# Altium schematic sheet Sheet1.SchDoc
size C; SheetNumber: 1; SheetTotal: 1
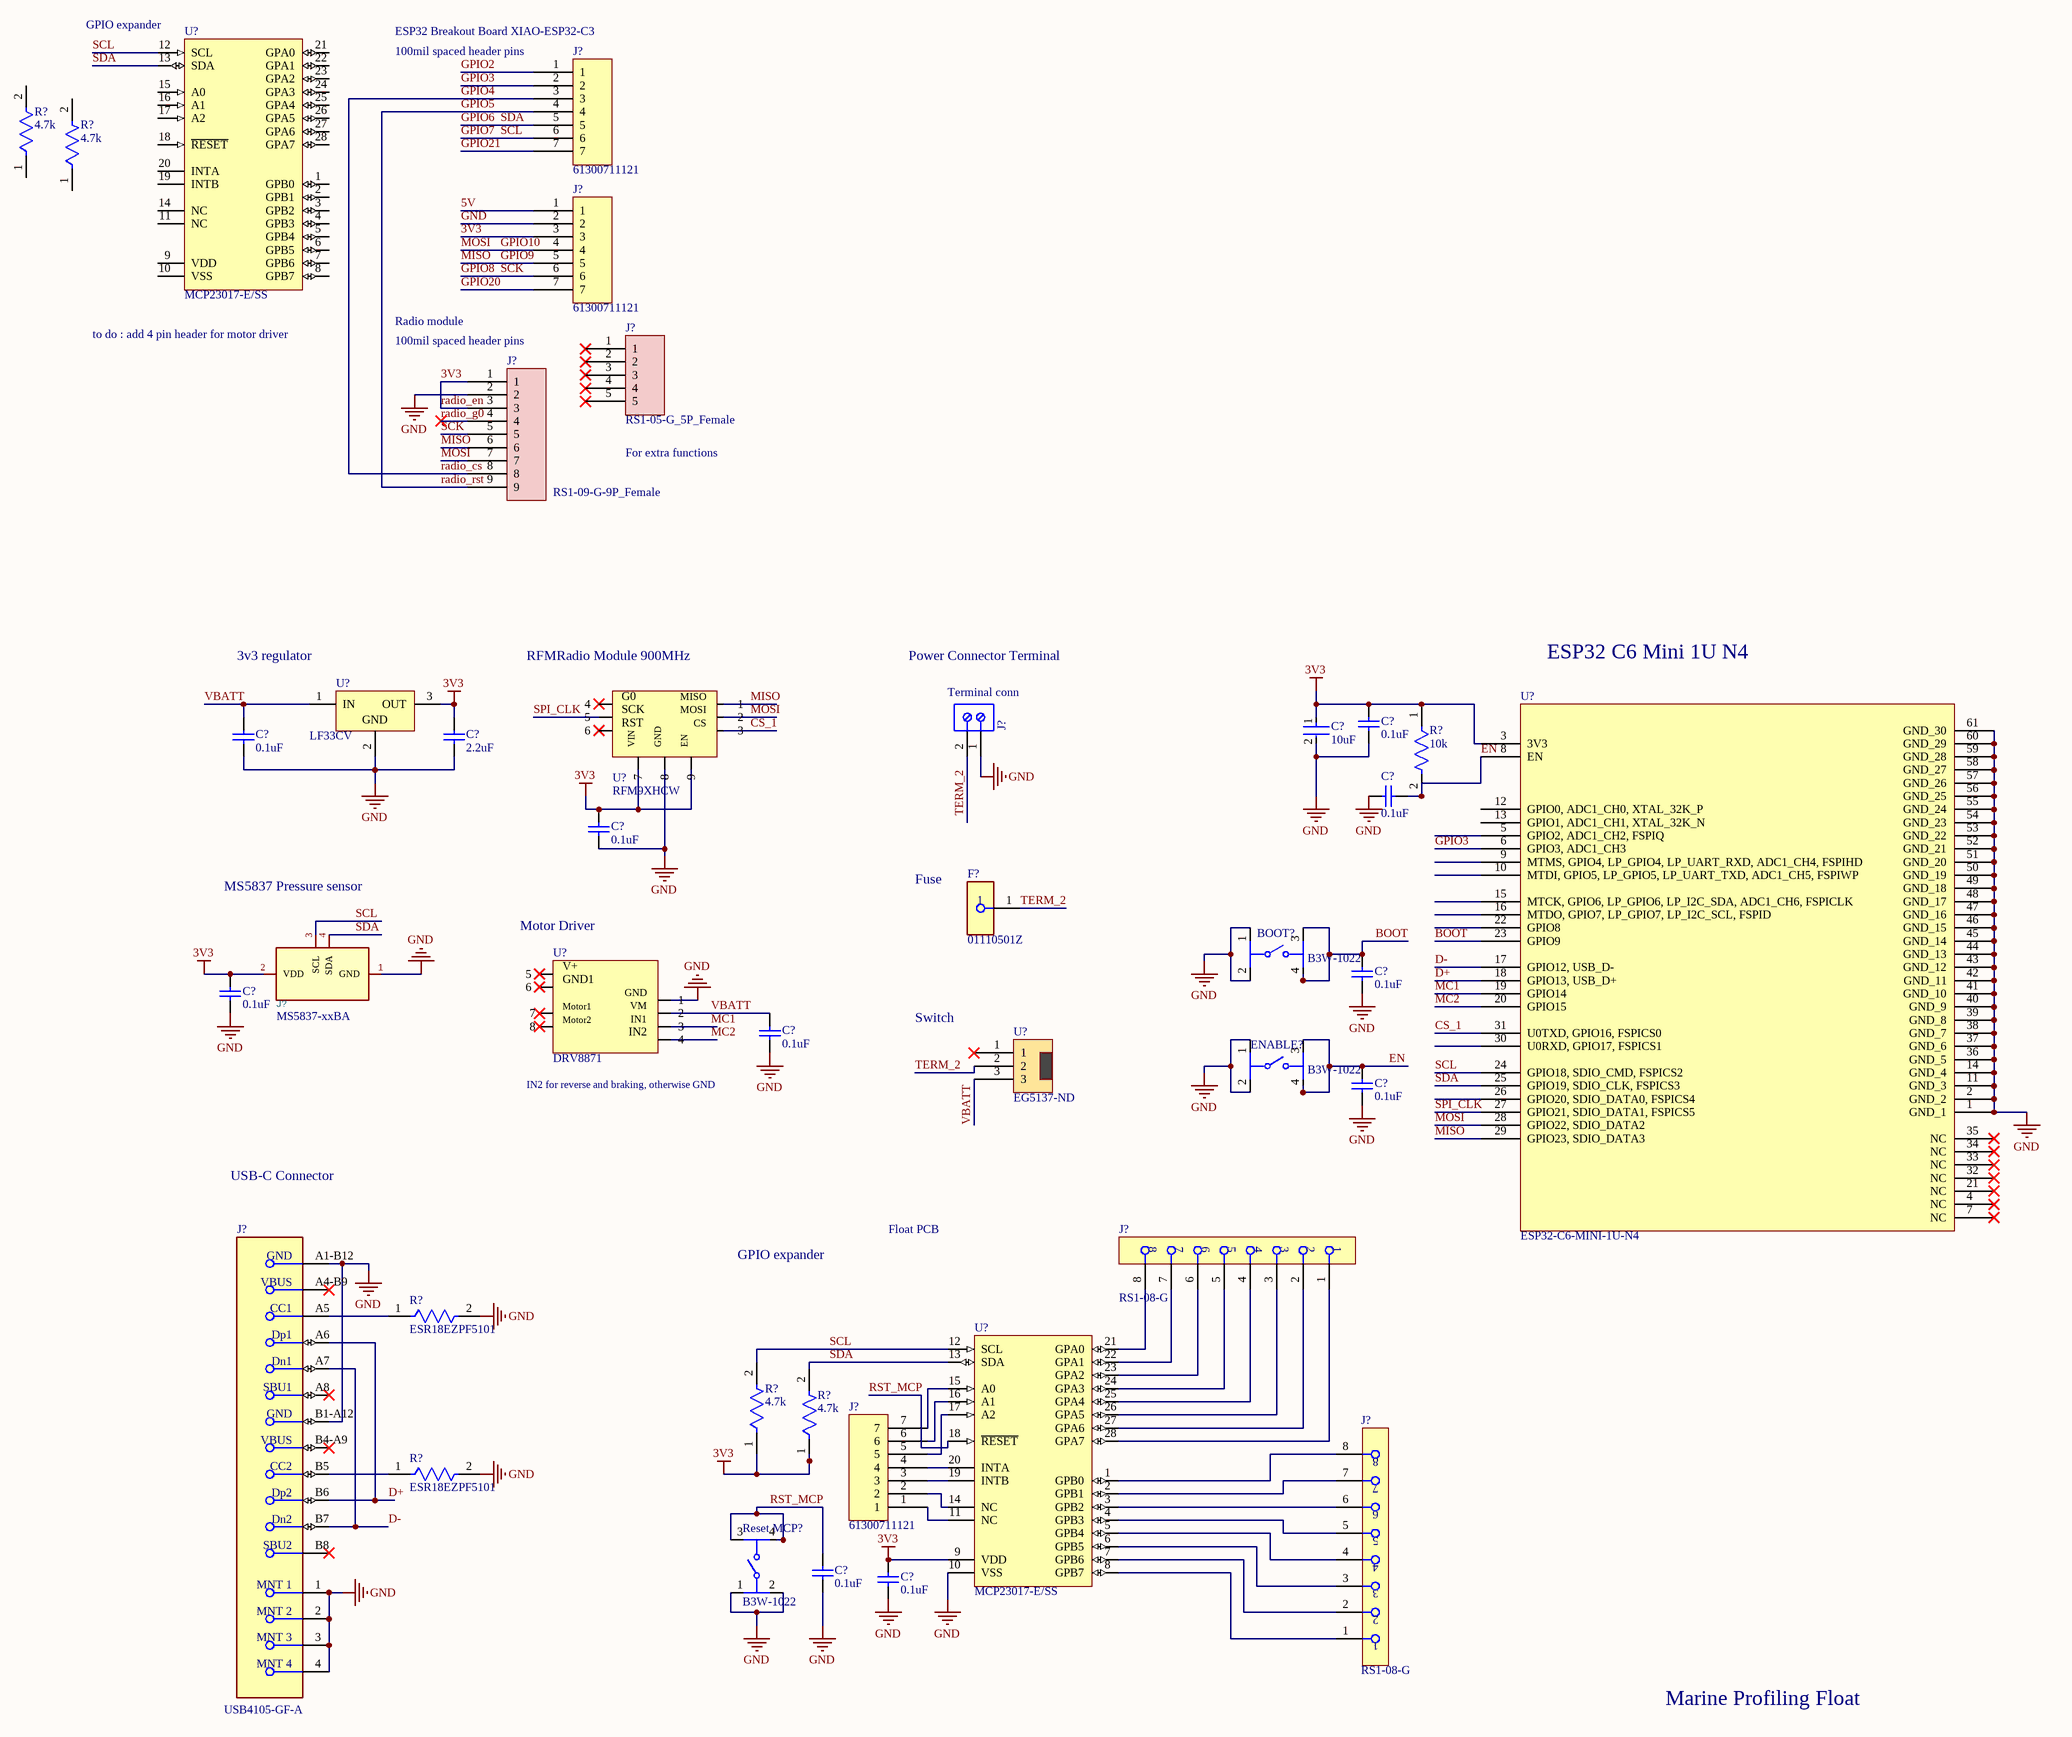
[diagram p0: Sheet1.SchDoc]

## Parts
(Parts that share a designator on the sheet are numbered #1, #2 ... from top to bottom, then left to right.)
BOOT?  B3W-1022  [FP-B3W-1022-MFG]
C?#1  10uF  [FP-GRM31C-0_2-e0_3_0_8-IPC_B]
C?#2  0.1uF  [CAPC0805(2012)100_M]
C?#3  0.1uF  [CAPC0805(2012)100_M]
C?#4  2.2uF  [CAPC2013X152X50ML20T25]
C?#5  0.1uF  [CAPC0805(2012)100_M]
C?#6  0.1uF  [CAPC0805(2012)100_M]
C?#7  0.1uF  [CAPC0805(2012)100_M]
C?#8  0.1uF  [CAPC0805(2012)100_M]
C?#9  0.1uF  [CAPC0805(2012)100_M]
C?#10  0.1uF  [CAPC0805(2012)100_M]
C?#11  0.1uF  [CAPC0805(2012)100_M]
C?#12  0.1uF  [CAPC0805(2012)100_M]
ENABLE?  B3W-1022  [FP-B3W-1022-MFG]
F?  01110501Z  [FP-01110501Z-MFG]
J?#1  61300711121
J?#2  61300711121
J?#3  RS1-05-G_5P_Female
J?#4  RS1-09-G-9P_Female
J?#5  Terminal conn  [691254410002]
J?#6  MS5837-xxBA
J?#7  USB4105-GF-A  [FP-USB4105-GF-A-MFG]
J?#8  RS1-08-G  [FP-RS1-08-G-MFG]
J?#9  61300711121
J?#10  RS1-08-G  [FP-RS1-08-G-MFG]
R?#1  4.7k  [FP-RCMM02-MFG]
R?#2  4.7k  [FP-RCMM02-MFG]
R?#3  10k  [FP-CRGCQ0805-IPC_C]
R?#4  ESR18EZPF5101  [FP-ESR18-IPC_A]
R?#5  4.7k  [FP-RCMM02-MFG]
R?#6  4.7k  [FP-RCMM02-MFG]
R?#7  ESR18EZPF5101  [FP-ESR18-IPC_A]
Reset_MCP?  B3W-1022  [FP-B3W-1022-MFG]
U?#1  MCP23017-E/SS  [SSOP-SS28_N]
U?#2  LF33CV  [TO220]
U?#3  RFM9XHCW
U?#4  ESP32-C6-MINI-1U-N4
U?#5  DRV8871
U?#6  EG5137-ND
U?#7  MCP23017-E/SS  [SSOP-SS28_N]

## Nets
3V3: C?#1.1 C?#2.2 C?#4.2 C?#6.2 C?#8.2 C?#12.2 J?#2.3 J?#4.1 J?#4.3 J?#6.2(VDD) R?#3.1 R?#5.1 R?#6.1 U?#2.3(OUT) U?#4.3(3V3) U?#7.9(VDD)  [also labelled radio_en]
GND: BOOT?.1 BOOT?.2 C?#1.2 C?#2.1 C?#3.1 C?#4.1 C?#5.1 C?#6.1 C?#7.1 C?#8.1 C?#9.1 C?#10.1 C?#11.1 C?#12.1 ENABLE?.1 ENABLE?.2 J?#2.2 J?#4.2 J?#5.1 J?#6.1(GND) J?#7.1(MNT_1) J?#7.2(MNT_2) J?#7.3(MNT_3) J?#7.4(MNT_4) J?#7.A1-B12(GND) J?#7.B1-A12(GND) R?#4.2 R?#7.2 Reset_MCP?.1 Reset_MCP?.2 U?#2.2(GND) U?#4.1(GND_1) U?#4.2(GND_2) U?#4.11(GND_3) U?#4.14(GND_4) U?#4.36(GND_5) U?#4.37(GND_6) U?#4.38(GND_7) U?#4.39(GND_8) U?#4.40(GND_9) U?#4.41(GND_10) U?#4.42(GND_11) U?#4.43(GND_12) U?#4.44(GND_13) U?#4.45(GND_14) U?#4.46(GND_15) U?#4.47(GND_16) U?#4.48(GND_17) U?#4.49(GND_18) U?#4.50(GND_19) U?#4.51(GND_20) U?#4.52(GND_21) U?#4.53(GND_22) U?#4.54(GND_23) U?#4.55(GND_24) U?#4.56(GND_25) U?#4.57(GND_26) U?#4.58(GND_27) U?#4.59(GND_28) U?#4.60(GND_29) U?#4.61(GND_30) U?#7.10(VSS)
5V: J?#2.1
BOOT: BOOT?.3 BOOT?.4 C?#7.2 U?#4.23(GPIO9)
CS_1: U?#4.31(U0TXD,_GPIO16,_FSPICS0)
D+: J?#7.A6(Dp1) J?#7.B6(Dp2) U?#4.18(GPIO13,_USB_D+)
D-: J?#7.A7(Dn1) J?#7.B7(Dn2) U?#4.17(GPIO12,_USB_D-)
EN: C?#5.2 C?#10.2 ENABLE?.3 ENABLE?.4 R?#3.2 U?#4.8(EN)
GPIO2: J?#1.1
GPIO3: J?#1.2 U?#4.6(GPIO3,_ADC1_CH3)
GPIO4: J?#1.3 J?#4.8  [also labelled radio_cs]
GPIO5: J?#1.4 J?#4.9  [also labelled radio_rst]
GPIO6: J?#1.5 J?#6.4(SDA) R?#6.2 U?#1.13(SDA) U?#4.25(GPIO19,_SDIO_CLK,_FSPICS3) U?#7.13(SDA)  [also labelled SDA]
GPIO7: J?#1.6 J?#6.3(SCL) R?#5.2 U?#1.12(SCL) U?#4.24(GPIO18,_SDIO_CMD,_FSPICS2) U?#7.12(SCL)  [also labelled SCL]
GPIO8: J?#2.6 J?#4.5  [also labelled SCK]
GPIO9: J?#2.5 J?#4.6 U?#4.29(GPIO23,_SDIO_DATA3)  [also labelled MISO]
GPIO10: J?#2.4 J?#4.7 U?#4.28(GPIO22,_SDIO_DATA2)  [also labelled MOSI]
GPIO20: J?#2.7
GPIO21: J?#1.7
MC1: U?#4.19(GPIO14)
MC2: U?#4.20(GPIO15)
radio_g0: J?#4.4
RST_MCP: C?#11.2 Reset_MCP?.3 Reset_MCP?.4 U?#7.18(~{RESET})
SPI_CLK: U?#4.27(GPIO21,_SDIO_DATA1,_FSPICS5)
TERM_2: F?.1 J?#5.2 U?#6.2
VBATT: C?#3.2 C?#9.2 U?#2.1(IN) U?#6.3
NetJ?#7_A5: J?#7.A5(CC1) R?#4.1
NetJ?#7_B5: J?#7.B5(CC2) R?#7.1
NetJ?#8_1: J?#8.1 U?#7.28(GPA7)
NetJ?#8_2: J?#8.2 U?#7.27(GPA6)
NetJ?#8_3: J?#8.3 U?#7.26(GPA5)
NetJ?#8_4: J?#8.4 U?#7.25(GPA4)
NetJ?#8_5: J?#8.5 U?#7.24(GPA3)
NetJ?#8_6: J?#8.6 U?#7.23(GPA2)
NetJ?#8_7: J?#8.7 U?#7.22(GPA1)
NetJ?#8_8: J?#8.8 U?#7.21(GPA0)
NetJ?#9_1: J?#9.1 U?#7.11(NC)
NetJ?#9_2: J?#9.2 U?#7.14(NC)
NetJ?#9_3: J?#9.3 U?#7.19(INTB)
NetJ?#9_4: J?#9.4 U?#7.20(INTA)
NetJ?#9_5: J?#9.5 U?#7.17(A2)
NetJ?#9_6: J?#9.6 U?#7.16(A1)
NetJ?#9_7: J?#9.7 U?#7.15(A0)
NetJ?#10_1: J?#10.1 U?#7.8(GPB7)
NetJ?#10_2: J?#10.2 U?#7.7(GPB6)
NetJ?#10_3: J?#10.3 U?#7.6(GPB5)
NetJ?#10_4: J?#10.4 U?#7.5(GPB4)
NetJ?#10_5: J?#10.5 U?#7.4(GPB3)
NetJ?#10_6: J?#10.6 U?#7.3(GPB2)
NetJ?#10_7: J?#10.7 U?#7.2(GPB1)
NetJ?#10_8: J?#10.8 U?#7.1(GPB0)

Not connected (* = marked no-connect by the designer): J?#3 1* 2* 3* 4* 5*; J?#7 A4-B9(VBUS)* A8(SBU1)* B4-A9(VBUS)* B8(SBU2)*; R?#1 1 2; R?#2 1 2; U?#1 1(GPB0) 2(GPB1) 3(GPB2) 4(GPB3) 5(GPB4) 6(GPB5) 7(GPB6) 8(GPB7) 9(VDD) 10(VSS) 11(NC) 14(NC) 15(A0) 16(A1) 17(A2) 18(~{RESET}) 19(INTB) 20(INTA) 21(GPA0) 22(GPA1) 23(GPA2) 24(GPA3) 25(GPA4) 26(GPA5) 27(GPA6) 28(GPA7); U?#3 CS(3) EN(9) G0(4) GND(8) MISO(1) MOSI(2) RST(6) SCK(5) VIN(7); U?#4 4(NC)* 5(GPIO2,_ADC1_CH2,_FSPIQ) 7(NC)* 9(MTMS,_GPIO4,_LP_GPIO4,_LP_UART_RXD,_ADC1_CH4,_FSPIHD) 10(MTDI,_GPIO5,_LP_GPIO5,_LP_UART_TXD,_ADC1_CH5,_FSPIWP) 12(GPIO0,_ADC1_CH0,_XTAL_32K_P) 13(GPIO1,_ADC1_CH1,_XTAL_32K_N) 15(MTCK,_GPIO6,_LP_GPIO6,_LP_I2C_SDA,_ADC1_CH6,_FSPICLK) 16(MTDO,_GPIO7,_LP_GPIO7,_LP_I2C_SCL,_FSPID) 21(NC)* 22(GPIO8) 26(GPIO20,_SDIO_DATA0,_FSPICS4) 30(U0RXD,_GPIO17,_FSPICS1) 32(NC)* 33(NC)* 34(NC)* 35(NC)*; U?#5 GND(1) GND1(6) IN1(3) IN2(4) Motor1(7) Motor2(8) V+(5) VM(2); U?#6 1*

## Notes on the sheet
- (near U?#1) GPIO expander
- (near J?#1) ESP32 Breakout Board XIAO-ESP32-C3
- (near J?#1) 100mil spaced header pins
- to do : add 4 pin header for motor driver
- (near J?#4) 100mil spaced header pins
- Radio module
- (near J?#3) For extra functions
- (near U?#2) 3v3 regulator
- (near U?#3) RFMRadio Module 900MHz
- Power Connector Terminal
- ESP32 C6 Mini 1U N4
- MS5837 Pressure sensor
- Fuse
- (near U?#5) Motor Driver
- Switch
- IN2 for reverse and braking, otherwise GND
- USB-C Connector
- GPIO expander
- Float PCB
- Marine Profiling Float

## Library data of the parts
BOOT? ENABLE? Reset_MCP? = CMP-08834-000055-1: SWITCH TACTILE SPST-NO 0.05A 24V; Operating Force: 230gf; Switch Function: Off-Mom; Switch Travel: 0.25mm; Throw Configuration: SPST; Actuator Type: Standard; Illumination Type: Non-Illuminated; Ratings: IP67; Mechanical Life: 1000000Cycles; Packaging: Bulk; Termination: PC Pin; Max Operating Temperature: 70°C; RoHS Compliant: Yes; Mount: Through Hole; Min Operating Temperature: -25°C
C?#1 = CMP-06035-043219-1: Chip Multilayer Ceramic Capacitors for General Purpose, 1206, 10uF, X7R, 15%, 20%, 25V
C?#2 C?#3 C?#5-C?#12 = CMP-1036-04393-1: CAP 100nF 10V ±5% 0805 (2012 Metric) Thickness 1mm SMD; Tolerance: Â±5%; Case-EIA: 0805; Case-Metric: 2012; Rated Voltage: 10 V; Technology: SMT; Value: 100nF; Max Thickness: 1 mm
C?#4 = CMP-2007-04515-1: Manufacturer: AVX Interconnect / Elco; Part Number: 08053C225MAT2A
F? = CMP-08604-000001-1: FUSE CLIP CARTRIDGE 250V 10A PCB; Manufacturer: Littelfuse; Is Female: yes; Number Of Fuses: 1; Description: 111 Spring Brass PCB Mount Fuse Clip For 2AG mm; 4.5 to 5 mm Cartridge Fuse; Conn Orientation: Horizontal; Voltage Rating Dc: 250V; Device Class L3: unset; Octopart: https://octopart.com/01110501z-littelfuse-7887867; RoHS: TRUE; Manufacturer Part Number: 01110501Z; Fuse Current: 10A; Lead Free: Yes; Package: 01110501Z; Mouser Description: Fuse Clips ACS 2AG PC MNT CLIP; Device Class L2: Fuse Holders; ComponentLink2URL: https://www.littelfuse.com/~/media/electronics/datasheets/fuse_clips/littelfuse_fuse_clip_111_datasheet.pdf.pdf; Voltage Rating Ac: 250V; ComponentLink2Description: Datasheet; Device Class L1: Circuit Protection; Automotive: No; Category: Fuse; Digikey Description: FUSE CLIP CARTRIDGE 250V 10A PCB; Height: 7mm
J?#1 J?#2 J?#9 = 61300711121: THT Vertical Pin Header WR-PHD, Pitch 2.54 mm, Single Row, 7 pins; Manufacturer: Wurth Elektronik; Connector Type: Male Pin; Contact Resistance: 20mΩ; Current Rating: 3A; Gender: Male; Insulation Resistance: 1GΩ; Number of Contacts: 7; Operating Supply Voltage: 250V; Pitch: 2.54mm; Supplier: DigiKey; Supplier Part Number: 732-5320-ND; Manufacturer Part Number: 61300711121; RoHS: Compliant; Category: Headers and Wire Housings; Stock: 6561; Pricing: 1=0.36, 10=0.309, 25=0.2576, 50=0.2152, 100=0.195, 1000=0.17756 (USD); Color: Black; Contact Material: Copper; Contact Mating Length: 5.9944mm; Contact Plating: Gold; Lead Pitch: 2.54mm; Length: 17.78mm; Max Operating Temperature: 105°C; Min Operating Temperature: -40°C; Mounting Technology: Through Hole; Pins: 7; Number of Positions: 7; Number of Rows: 1; Orientation: Vertical; Packaging: Bulk; Termination: Solder; ComponentLink1URL: https://datasheet.octopart.com:443/61300711121-Wurth-Elektronik-datasheet-169474601.pdf?src-supplier=Wurth+Elektronik; ComponentLink1Description: https://datasheet.octopart.com:443/61300711121-Wurth-Elektronik-datasheet-169474601.pdf?src-supplier=Wurth+Elektronik; ComponentLink2URL: https://datasheet.octopart.com:443/61300711121-W%C3%BCrth-Elektronik-datasheet-44382959.pdf?src-supplier=Wurth+Elektronik; ComponentLink2Description: https://datasheet.octopart.com:443/61300711121-W%C3%BCrth-Elektronik-datasheet-44382959.pdf?src-supplier=Wurth+Elektronik; ComponentLink3URL: https://datasheet.octopart.com:443/61300711121-W%C3%BCrth-Elektronik-datasheet-149524083.pdf?src-supplier=Farnell; ComponentLink3Description: https://datasheet.octopart.com:443/61300711121-W%C3%BCrth-Elektronik-datasheet-149524083.pdf?src-supplier=Farnell; ComponentLink4URL: https://datasheet.octopart.com:443/61300711121-W%C3%BCrth-Elektronik-datasheet-21154836.pdf?src-supplier=element14+APAC; ComponentLink4Description: https://datasheet.octopart.com:443/61300711121-W%C3%BCrth-Elektronik-datasheet-21154836.pdf?src-supplier=element14+APAC
J?#3 = RS1-05-G: Connector, Receptacle Strip, 5 Position, 2.54MM Pitch, Single Row; Manufacturer: Adam Tech; Contact Resistance: 20mΩ; Current Rating: 3A; Insulation Resistance: 5GΩ; Supplier: DigiKey; Supplier Part Number: 2057-RS1-05-G-ND; Manufacturer Part Number: RS1-05-G; RoHS: Compliant; Category: Card Edge Connectors; Stock: 5746; Pricing: 1=0.31, 10=0.264, 100=0.2239, 500=0.19986, 3000=0.17609, 6000=0.16769, 12000=0.15968 (USD); Contact Gender: Female; Export Control Classification Number (ECCN) Code: EAR99; Harmonized Tariff Schedule (HTS) Code: 8536.69.40.40; Introduction Date: 2005-04-14; Lifecycle Status: Production; Max Operating Temperature: 105°C; Min Operating Temperature: -40°C; Pins: 5; Number of Rows: 1; Pitch: 2.54mm; REACH SVHC: Yes; Terminal Pitch: 2.54mm; Termination: PCB; ComponentLink1URL: https://datasheet.octopart.com:443/RS1-05-G-Adam-Tech-datasheet-65807175.pdf?src-supplier=IHS; ComponentLink1Description: https://datasheet.octopart.com:443/RS1-05-G-Adam-Tech-datasheet-65807175.pdf?src-supplier=IHS; ComponentLink2URL: http://sigma.octopart.com:80/reach_statement/Adam-Tech-company-23.pdf?src-supplier=Compliance+Statements; ComponentLink2Description: http://sigma.octopart.com:80/reach_statement/Adam-Tech-company-23.pdf?src-supplier=Compliance+Statements; ComponentLink3URL: http://sigma.octopart.com:80/rohs_statement/Adam-Tech-company-22.pdf?src-supplier=Compliance+Statements; ComponentLink3Description: http://sigma.octopart.com:80/rohs_statement/Adam-Tech-company-22.pdf?src-supplier=Compliance+Statements
J?#4 = RS1-09-G: Connector, Receptacle Strip, 9 Position, 2.54MM Pitch, Single Row; Manufacturer: Adam Tech; Contact Resistance: 20mΩ; Current Rating: 3A; Insulation Resistance: 5GΩ; Supplier: DigiKey; Supplier Part Number: 2057-RS1-09-G-ND; Manufacturer Part Number: RS1-09-G; RoHS: Compliant; Category: Card Edge Connectors; Stock: 1265; Pricing: 1=0.49, 80=0.35963, 160=0.34244, 560=0.31345, 1040=0.30004, 5040=0.26841, 10000=0.25575 (USD); Contact Gender: Female; Export Control Classification Number (ECCN) Code: EAR99; Harmonized Tariff Schedule (HTS) Code: 8536.69.40.40; Introduction Date: 2005-04-14; Lifecycle Status: Production; Max Operating Temperature: 105°C; Min Operating Temperature: -40°C; Pins: 9; Number of Rows: 1; REACH SVHC: Yes; Terminal Pitch: 2.54mm; ComponentLink1URL: https://datasheet.octopart.com:443/RS1-09-G-Adam-Tech-datasheet-65807175.pdf?src-supplier=IHS; ComponentLink1Description: https://datasheet.octopart.com:443/RS1-09-G-Adam-Tech-datasheet-65807175.pdf?src-supplier=IHS; ComponentLink2URL: http://sigma.octopart.com:80/reach_statement/Adam-Tech-company-23.pdf?src-supplier=Compliance+Statements; ComponentLink2Description: http://sigma.octopart.com:80/reach_statement/Adam-Tech-company-23.pdf?src-supplier=Compliance+Statements; ComponentLink3URL: http://sigma.octopart.com:80/rohs_statement/Adam-Tech-company-22.pdf?src-supplier=Compliance+Statements; ComponentLink3Description: http://sigma.octopart.com:80/rohs_statement/Adam-Tech-company-22.pdf?src-supplier=Compliance+Statements
J?#5 = CMP-1502-02748-3: Terminal Block, 7.62MM Pitch, Horizontal, Dual Pin, 12-30 AWG, 2 Pin
J?#6 = MS5837-xxBA: Ultra-small, gel-filled, pressure sensor with stainless steel cap; ki_fp_filters: TE_MS5837*BA*; Footprint: Sensor_Pressure:TE_MS5837-xxBA; Datasheet: https://www.te.com/commerce/DocumentDelivery/DDEController?Action=showdoc&DocId=Data+Sheet%7FMS5837-30BA%7FB1%7Fpdf%7FEnglish%7FENG_DS_MS5837-30BA_B1.pdf%7FCAT-BLPS0017; Description_: Ultra-small, gel-filled, pressure sensor with stainless steel cap; ki_keywords: pressure sensor
J?#7 = CMP-245163-000001-1: CONN RCPT USB2.0 TYPEC 5A; Manufacturer: GCT; Voltage Rating: 20V; Is Female: yes; Current Rating: 5/6.25/1.25/0.25A; Number Of Contacts: 16; Conn Orientation: Right Angle; Device Class L1: Connectors; Category: Conn; Lead Free: Yes; RoHS: TRUE; Temperature Range High: +85°C; Digikey Description: CONN RCPT USB2.0 TYPEC 5A; Device Class L3: unset; ComponentLink2Description: Datasheet; Manufacturer Part Number: USB4105-GF-A; Package: 0; Usb Standard: USB 2.0; Device Class L2: USB Connectors; Automotive: No; Temperature Range Low: -40°C; Height: 3.46mm; Temperature: -40°C to +85°C; Contact Material: Gold,Nickel; ComponentLink2URL: https://gct.co/files/drawings/usb4105.pdf; Octopart: https://octopart.com/usb4105-gf-a-gct-106627878
J?#8 J?#10 = CMP-02275-20083808-1: RS1-08-G Connector, receptacle strip, 8 position, 2.54MM pitch, single row; Number of Contacts: 8; Current Rating: 3A; Pitch: 2.54mm; Height: 8.89mm; Max Operating Temperature: 105°C; Schedule B: 8536694040, 8536694040; Number of Rows: 1; Contact Material: Gold, Nickel; RoHS: Compliant; Termination: PCB; NexarPartId: 20083808; Min Operating Temperature: -40°C; Contact Gender: Female
R?#1 R?#2 R?#5 R?#6 = CMP-02408-000034-1: RES 4.7K OHM 2% 1/2W AXIAL; Temperature Coefficient: 100ppm/°C; Resistance: 4.7kR; RoHS Compliant: Yes; Contact Plating: Tin; Tolerance: 2%; Diameter: 2.5mm; Case/Package: Molded; Length: 6.5mm; Mount: Through Hole; Resistor Type: Metal Film
R?#3 = CMP-03211-002989-1: CRGCQ 0805 10K 5%; Manufacturer Part Number: CRGCQ0805J10K; Manufacturer: TE Connectivity; Voltage Rating: 150V; Temperature Coefficient: ±100ppm/°C; Resistance: 10KΩ; Value: 10KΩ; Power Rating: 0.125W; Tolerance: 0.05; Automotive Grade: Grade 914; Height: 0.65mm; Lead Free: Yes; Temperature Range High: +155°C; Composition: Thick Film; Temperature Range Low: -55°C; Ambient Temperature Range High: +70°C; Temperature: -55°C to +155°C; Package: CRGCQ0805; Device Class L2: Resistors; RoHS: TRUE; ComponentLink2URL: https://www.te.com/commerce/DocumentDelivery/DDEController?Action=showdoc&DocId=Data+Sheet%7F1773204-3%7F1%7Fpdf%7FEnglish%7FENG_DS_1773204-3_1.pdf%7F4-2176341-923; Series: CRGCQ; Device Class L1: Passive Components; Ipc Land Pattern Name: RESC200125X55; ComponentLink2Description: Datasheet; Category: Res; Digikey Description: CRGCQ 0805 10K 5%; Mouser Description: Res Thick Film 0805 10K Ohm 5% 0.125W(1/8W) ±100ppm/C Pad SMD Automotive T/R; Automotive: Yes; Octopart: https://octopart.com/crgcq0805j10k-te+connectivity-91018201; Device Class L3: Chip SMD Resistors
R?#4 R?#7 = CMP-08839-028234-1: 5.1kΩ ±1% 0.5W 1206 Anti-Surge Chip Resistor AEC-Q200; Temperature Coefficient: 100ppm/°C; Max Power Dissipation: 333mW; Resistance: 5.1kR; Resistor Type: Thick Film; Max Operating Temperature: 155°C; Min Operating Temperature: -55°C; Features: Automotive AEC-Q200; Height: 0.026inch; Length: 0.126inch; Packaging: Tape and Reel; Width: 0.063inch; Case/Package: 1206; Tolerance: 1%; Series: ESR18; Number of Terminations: 2; RoHS Compliant: Yes; Package Quantity: 5000
U?#1 U?#7 = CMP-0186-00176-2: 16-Bit I/O Expander with Serial Interface, 28-Pin SSOP, Extended Temperature; PackageVersion: revBB, Aug-2009; ComponentLink1Description: Manufacturer URL; ComponentLink3Description: Package Specification; PackageDescription: 28-Lead Plastic Shrink Small Outline (SS) - 5.3mm Body [SSOP]; ComponentLink1URL: http://www.microchip.com/; Code_JEDEC: MS-150; RevisionNote: URLs added.; ComponentLink3URL: http://www.microchip.com/stellent/groups/techpub_sg/documents/packagingspec/en012702.pdf; ComponentLink2URL: http://ww1.microchip.com/downloads/en/DeviceDoc/21952b.pdf; ComponentLink2Description: Datasheet; PackageReference: SSOP-SS28; DatasheetVersion: revB, Feb-2007
U?#2 = CMP-0244-00432-1: 500mA, Very Low Drop (0.45V) Voltage Regulator, 3.3V, 3-Pin TO-220; PackageVersion: ver3.0; ComponentLink1URL: http://www.st.com; ComponentLink2URL: http://www.st.com/internet/com/TECHNICAL_RESOURCES/TECHNICAL_LITERATURE/DATASHEET/CD00000546.pdf; PackageDescription: TO, Thru-Hole, Vertical, Heatsink Mounted; 3 In-Line Leads; Pitch 2.54 mm; PackageReference: TO220; ComponentLink3Description: Package Specification; ComponentLink2Description: Datasheet; DatasheetVersion: 1/11/2010; ComponentLink3URL: http://www.st.com/internet/com/TECHNICAL_RESOURCES/TECHNICAL_LITERATURE/PACKAGE_INFORMATION/CD00004649.pdf; ComponentLink1Description: Manufacturer URL
U?#3 = RFM9XHCW: Adafruit Radio Module
U?#4 = ESP32-C6-MINI-1U-N4: WiFi-Module 802.11 2, 4GHz 150Mb/s; Manufacturer: Espressif Systems; Max Supply Voltage: 3.6V; Min Supply Voltage: 3V; Operating Supply Voltage: 3.3V; Supplier: DigiKey; Supplier Part Number: 1965-ESP32-C6-MINI-1U-N4CT-ND; Manufacturer Part Number: ESP32-C6-MINI-1U-N4; Category: System on Chip (SoC); Stock: 154; Pricing: 1=4.45, 10=3.845, 25=3.6364, 100=3.3486, 250=3.17616 (USD); Height - Seated (Max): 2.55mm; Harmonized Tariff Schedule (HTS) Code: 8542.31.00.30; Length: 13.2mm; Max Operating Temperature: 85°C; Min Operating Temperature: -40°C; Number of Terminals: 53; Terminal Pitch: 800µm; Width: 12.5mm; ComponentLink1URL: https://datasheet.octopart.com:443/ESP32-C6-MINI-1U-N4-Espressif-Systems-datasheet-182247771.pdf?src-supplier=TME; ComponentLink1Description: https://datasheet.octopart.com:443/ESP32-C6-MINI-1U-N4-Espressif-Systems-datasheet-182247771.pdf?src-supplier=TME; ComponentLink2URL: https://datasheet.octopart.com:443/ESP32-C6-MINI-1U-N4-Espressif-Systems-datasheet-188867343.pdf?src-supplier=TME; ComponentLink2Description: https://datasheet.octopart.com:443/ESP32-C6-MINI-1U-N4-Espressif-Systems-datasheet-188867343.pdf?src-supplier=TME
U?#5 = DRV8871: Motor Driver 6.5V-45VDC In
U?#6 = 500SSP1S2M2QEA: Switch Slide ON None ON SPDT Extended Top Slide 5A 250VAC 28VDC PC Pins Thru-Hole; Manufacturer: E-Switch; Actuator Length: 7.239mm; Actuator Material: Nylon; Contact Current Rating: 2A; Contact Resistance: 10mΩ; Contact Voltage Rating (AC): 250V; Electrical Life: 30kcycles; Insulation Resistance: 1GΩ; Max Voltage Rating (DC): 28V; Number of Positions: 1; Sealable: EPOXY; Switch Function: On-On; Switch Travel: 2.16mm; Voltage Rating (AC): 120V; Supplier: DigiKey; Supplier Part Number: EG5137-ND; Manufacturer Part Number: 500SSP1S2M2QEA; RoHS: Compliant; Category: Slide Switches; Stock: 7980; Pricing: 1=3.29, 10=2.758, 25=2.556, 126=2.23468, 252=2.11369, 504=2.00373, 1008=1.90486, 2520=1.79075, 5040=1.71628 (USD); Contact Material: Copper; Contact Plating: Silver; Current Rating: 5A; Export Control Classification Number (ECCN) Code: EAR99; Housing Material: Stainless Steel; Harmonized Tariff Schedule (HTS) Code: 8536.50.70.00; Introduction Date: 2000-02-16; Length: 12.8524mm; Lifecycle Status: Production; Max Current Rating: 5A; Max Operating Temperature: 85°C; Mechanical Life: 30kcycles; Min Operating Temperature: -30°C; Mounting Technology: Through Hole; Orientation: Vertical; REACH SVHC: Yes; Termination: PC Pin; Throw Configuration: SPDT; Voltage Rating (DC): 28V; ComponentLink1URL: https://datasheet.octopart.com:443/500SSP1S2M2QEA-E-Switch-datasheet-41192586.pdf?src-supplier=element14+APAC; ComponentLink1Description: https://datasheet.octopart.com:443/500SSP1S2M2QEA-E-Switch-datasheet-41192586.pdf?src-supplier=element14+APAC; ComponentLink2URL: https://datasheet.octopart.com:443/500SSP1S2M2QEA-E-Switch-datasheet-156105959.pdf?src-supplier=Future+Electronics; ComponentLink2Description: https://datasheet.octopart.com:443/500SSP1S2M2QEA-E-Switch-datasheet-156105959.pdf?src-supplier=Future+Electronics; ComponentLink3URL: https://datasheet.octopart.com:443/500SSP1S2M2QEA-E-Switch-datasheet-169364037.pdf?src-supplier=New+Yorker+Electronics; ComponentLink3Description: https://datasheet.octopart.com:443/500SSP1S2M2QEA-E-Switch-datasheet-169364037.pdf?src-supplier=New+Yorker+Electronics; ComponentLink4URL: https://datasheet.octopart.com:443/500SSP1S2M2QEA-E-Switch-datasheet-33408909.pdf?src-supplier=Electro+Sonic; ComponentLink4Description: https://datasheet.octopart.com:443/500SSP1S2M2QEA-E-Switch-datasheet-33408909.pdf?src-supplier=Electro+Sonic